# Altium project Speedometer_Tech.PrjPcb
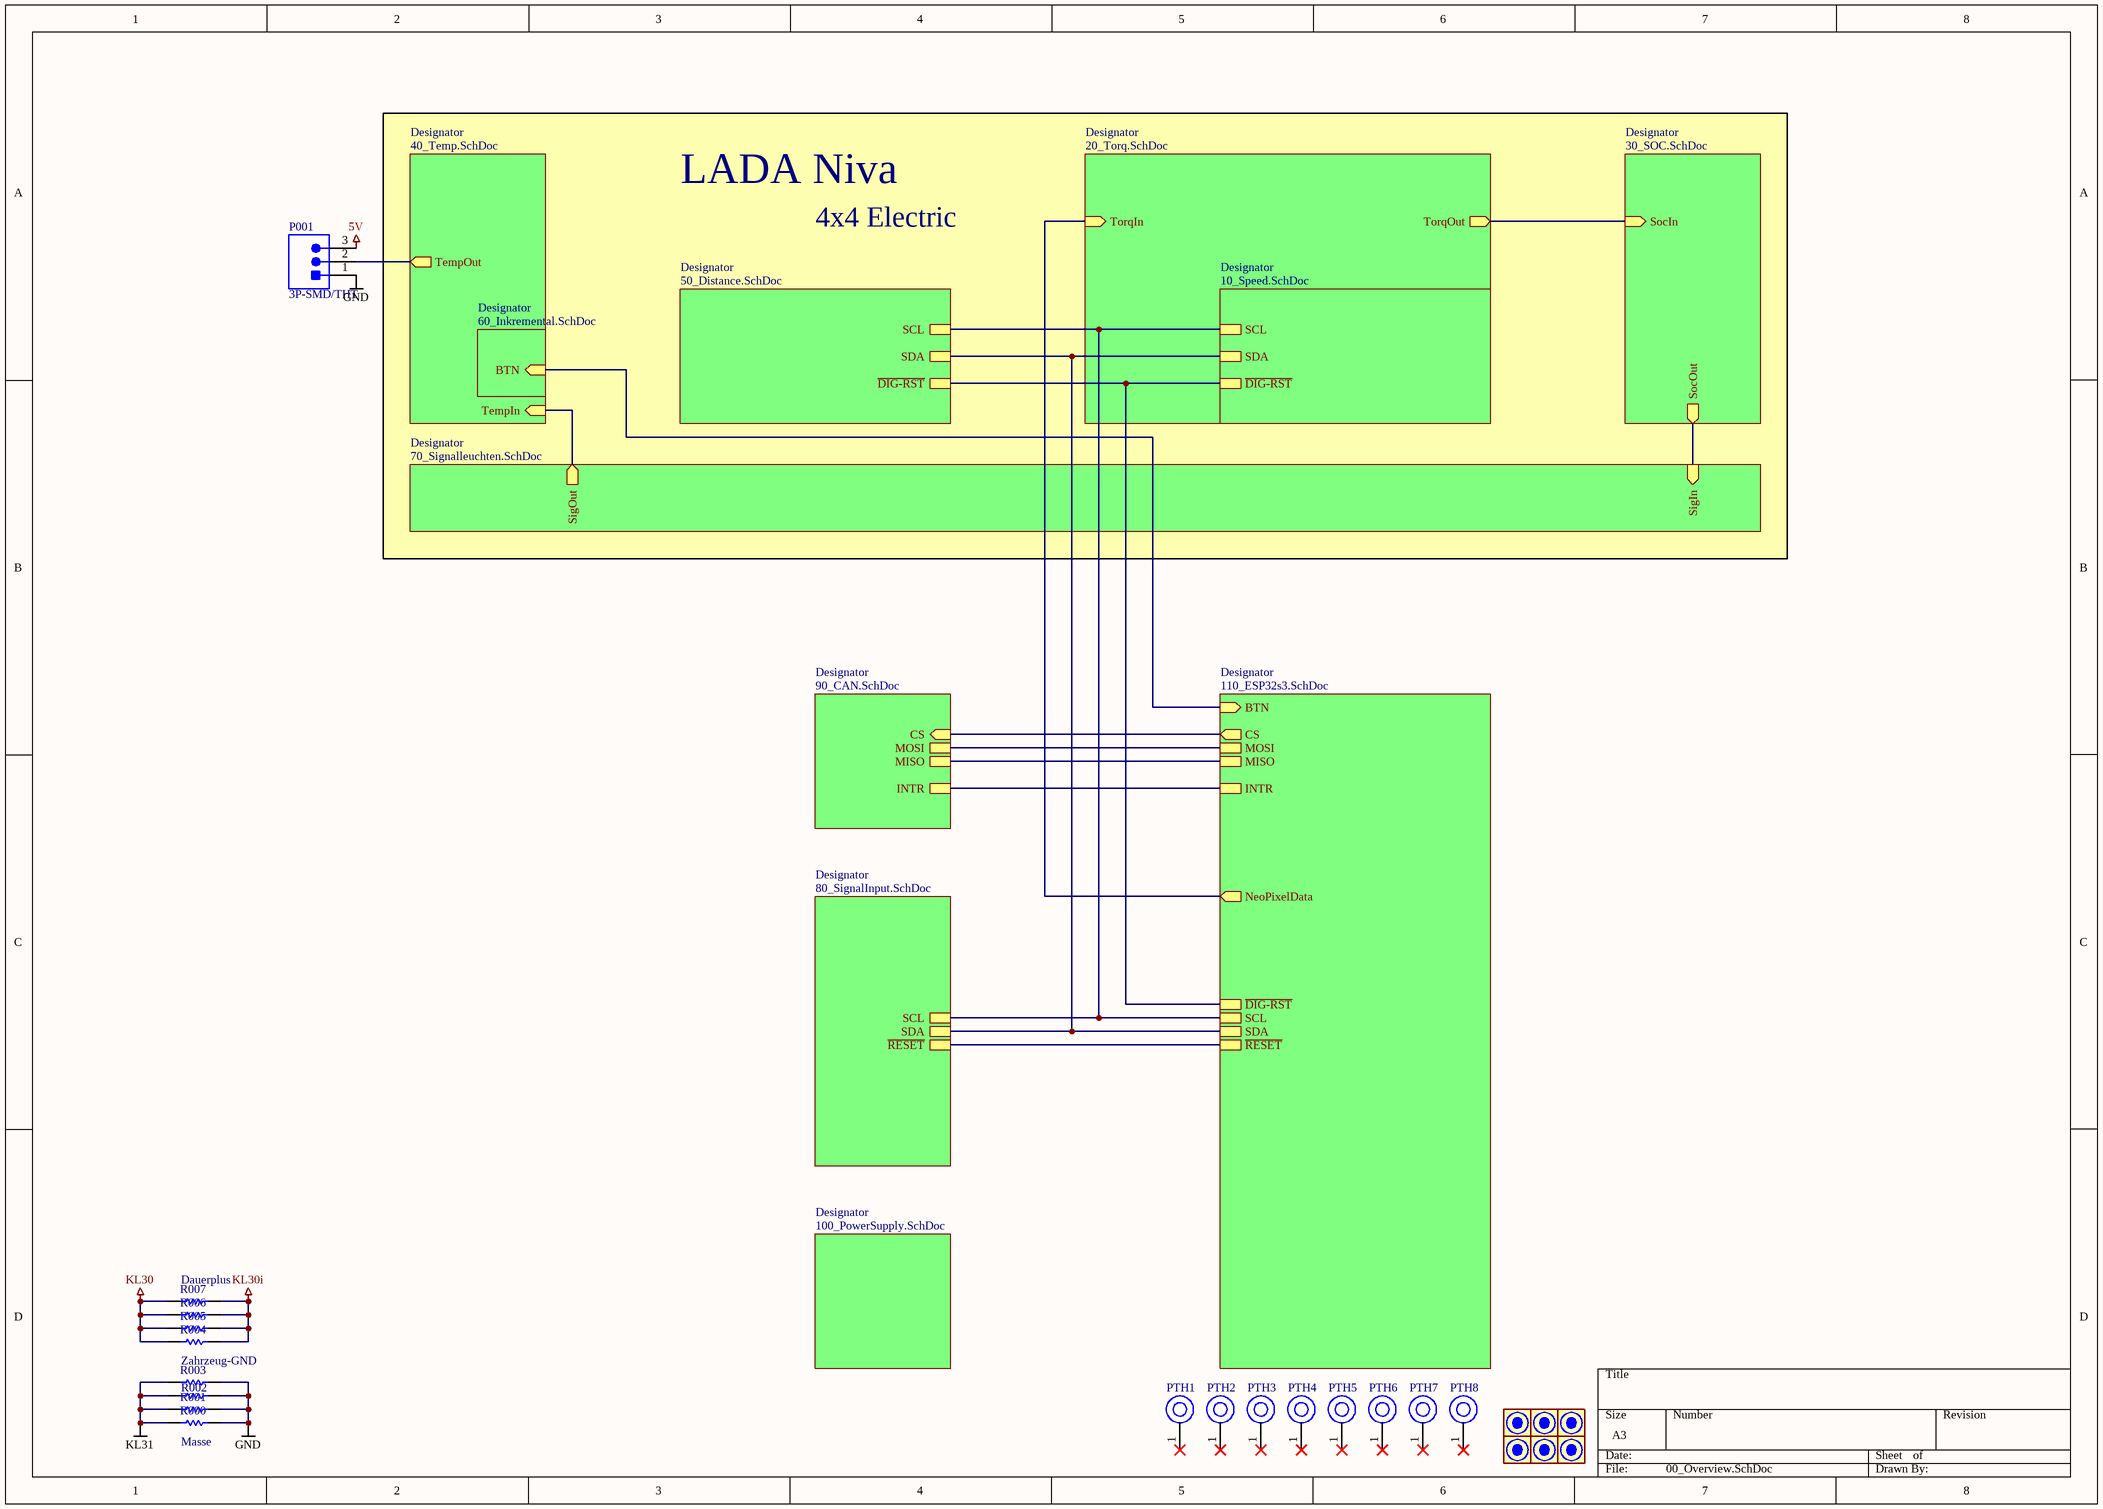
[diagram p0: 00_Overview.SchDoc]
4 sheets, 89 parts. Net scope: hierarchical (ports join the sheet entries above them; power ports are global).
Board file: Speedometer_Tech.PcbDoc
Sheets:
  00_Overview.SchDoc
    Designator = 20_Torq.SchDoc
    Designator = 30_SOC.SchDoc
    Designator = 80_SignalInput.SchDoc

## Sheet 00_Overview.SchDoc
size A3; SheetNumber: 1; SheetTotal: 12

### Parts
(Parts that share a designator on the sheet are numbered #1, #2 ... from top to bottom, then left to right.)
M*#1  Passermarke  [Passermarke-Footprint-1]  (value not drawn)
M*#2  Passermarke  [Passermarke-Footprint-1]  (value not drawn)
M*#3  Passermarke  [Passermarke-Footprint-1]  (value not drawn)
M*#4  Passermarke  [Passermarke-Footprint-1]  (value not drawn)
M*#5  Passermarke  [Passermarke-Footprint-1]  (value not drawn)
M*#6  Passermarke  [Passermarke-Footprint-1]  (value not drawn)
P001  3P-SMD/THT  [3P-SMD/THT]
PTH1  PTH-M4D7X7  [PTH-M4D7X7-Footprint-1]  (value not drawn)
PTH2  PTH-M4D7X7  [PTH-M4D7X7-Footprint-1]  (value not drawn)
PTH3  PTH-M4D7X7  [PTH-M4D7X7-Footprint-1]  (value not drawn)
PTH4  PTH-M4D7X7  [PTH-M4D7X7-Footprint-1]  (value not drawn)
PTH5  PTH-M4D7X7  [PTH-M4D7X7-Footprint-1]  (value not drawn)
PTH6  PTH-M4D7X7  [PTH-M4D7X7-Footprint-1]  (value not drawn)
PTH7  PTH-M4D7X7  [PTH-M4D7X7-Footprint-1]  (value not drawn)
PTH8  PTH-M4D7X7  [PTH-M4D7X7-Footprint-1]  (value not drawn)
R000  RC0603JR-070RL  [RESC1608X55X25ML10T15]  (value not drawn)
R001  RC0603JR-070RL  [RESC1608X55X25ML10T15]  (value not drawn)
R002  RC0603JR-070RL  [RESC1608X55X25ML10T15]  (value not drawn)
R003  RC0603JR-070RL  [RESC1608X55X25ML10T15]  (value not drawn)
R004  RC0603JR-070RL  [RESC1608X55X25ML10T15]  (value not drawn)
R005  RC0603JR-070RL  [RESC1608X55X25ML10T15]  (value not drawn)
R006  RC0603JR-070RL  [RESC1608X55X25ML10T15]  (value not drawn)
R007  RC0603JR-070RL  [RESC1608X55X25ML10T15]  (value not drawn)

### Sub-sheets
Designator = 110_ESP32s3.SchDoc (file not in this document): CS (out), INTR, MOSI, MISO, SCL, SDA, ~{RESET}, NeoPixelData (out), ~{DIG-RST}, BTN (in)
Designator = 20_Torq.SchDoc: TorqIn (in), TorqOut (out)
Designator = 10_Speed.SchDoc (file not in this document): SCL, SDA, ~{DIG-RST}
Designator = 30_SOC.SchDoc: SocIn (in), SocOut (out)
Designator = 40_Temp.SchDoc (file not in this document): TempOut (out), TempIn (in)
Designator = 70_Signalleuchten.SchDoc (file not in this document): SigIn (in), SigOut (out)
Designator = 50_Distance.SchDoc (file not in this document): SCL, SDA, ~{DIG-RST}
Designator = 60_Inkremental.SchDoc (file not in this document): BTN (in)
Designator = 80_SignalInput.SchDoc: SCL, SDA, ~{RESET}
Designator = 100_PowerSupply.SchDoc (file not in this document): no entries
Designator = 90_CAN.SchDoc (file not in this document): CS (in), INTR, MOSI, MISO

### Nets
5V: P001.3
GND: P001.1 R000.2 R001.2 R002.2 R003.2
KL30: R004.1 R005.1 R006.1 R007.1
KL30i: R004.2 R005.2 R006.2 R007.2
KL31: R000.1 R001.1 R002.1 R003.1
NetP001_2: P001.2 ; sheet Designator/TempOut
NetU204_1: sheet Designator/NeoPixelData, sheet Designator/TorqIn
NetU223_3: sheet Designator/TorqOut, sheet Designator/SocIn
NetU320_3: sheet Designator/SocOut, sheet Designator/SigIn
NetU840_12: sheet Designator/SCL, sheet Designator/SCL, sheet Designator/SCL, sheet Designator/SCL
NetU840_13: sheet Designator/SDA, sheet Designator/SDA, sheet Designator/SDA, sheet Designator/SDA
NetU840_18: sheet Designator/~{RESET}, sheet Designator/~{RESET}
(unnamed): sheet Designator/CS, sheet Designator/CS
(unnamed): sheet Designator/INTR, sheet Designator/INTR
(unnamed): sheet Designator/MOSI, sheet Designator/MOSI
(unnamed): sheet Designator/MISO, sheet Designator/MISO
(unnamed): sheet Designator/~{DIG-RST}, sheet Designator/~{DIG-RST}, sheet Designator/~{DIG-RST}
(unnamed): sheet Designator/BTN, sheet Designator/BTN
(unnamed): sheet Designator/TempIn, sheet Designator/SigOut

Not connected (* = marked no-connect by the designer): PTH1 1*; PTH2 1*; PTH3 1*; PTH4 1*; PTH5 1*; PTH6 1*; PTH7 1*; PTH8 1*

### Notes on the sheet
- LADA Niva
- 4x4 Electric
- (near R007) Dauerplus
- Zahrzeug-GND
- (near R000) Masse

### Library data of the parts
M*#1-M*#6 = CMP-00001-2
PTH1-PTH8 = CMP-00028-00009-2: Mounting hole M4
R000 R001 R002 R003 R004 R005 R006 R007 = CMP-2100-03667-1: Chip Resistor, 0 Ohm, +/- 5%, 0.1 W, -55 to 155 degC, 0603 (1608 Metric), RoHS, Tape and Reel; Manufacturer: Yageo; Temperature Coefficient: 200ppm/degreesC; Voltage Rating: 50V; Power Rating: 100mW; Resistance: 0mOhm; Width: 0.8mm; Max Operating Temperature: 155degC; Tolerance: 5%; Package Reference: 0603; Height: 0.45mm; Depth: 0.8mm; Package Description: 2-Pin Surface Mount Device, Body 1.6 x 0.8 mm; Termination: SMD/SMT; Package Quantity: 5000; Case/Package: 0603; Case Code (Imperial): 0603; Radiation Hardening: No; Number of Pins: 2; Length: 1.6mm; Lead Free: LeadFree; Voltage Rating (DC): 50V; Military Standard: Not; Datasheet URL: http://www.yageo.com/NewPortal/yageodocoutput?fileName=/pdf/R-Chip/PYu-RC_Group_51_RoHS_L_5.pdf; Manufacturer URL: http://www.yageo.com/; Packaging: TapeandReel; Case Code (Metric): 1608; Min Operating Temperature: -55degC; Composition: ThickFilm; RoHSCompliant: true; Contact Plating: Tin; Datasheet Version: Rev. 5, 10/2016; REACH SVHC: NoSVHC

## Sheet 20_Torq.SchDoc
size A3; SheetNumber: 3; SheetTotal: 12
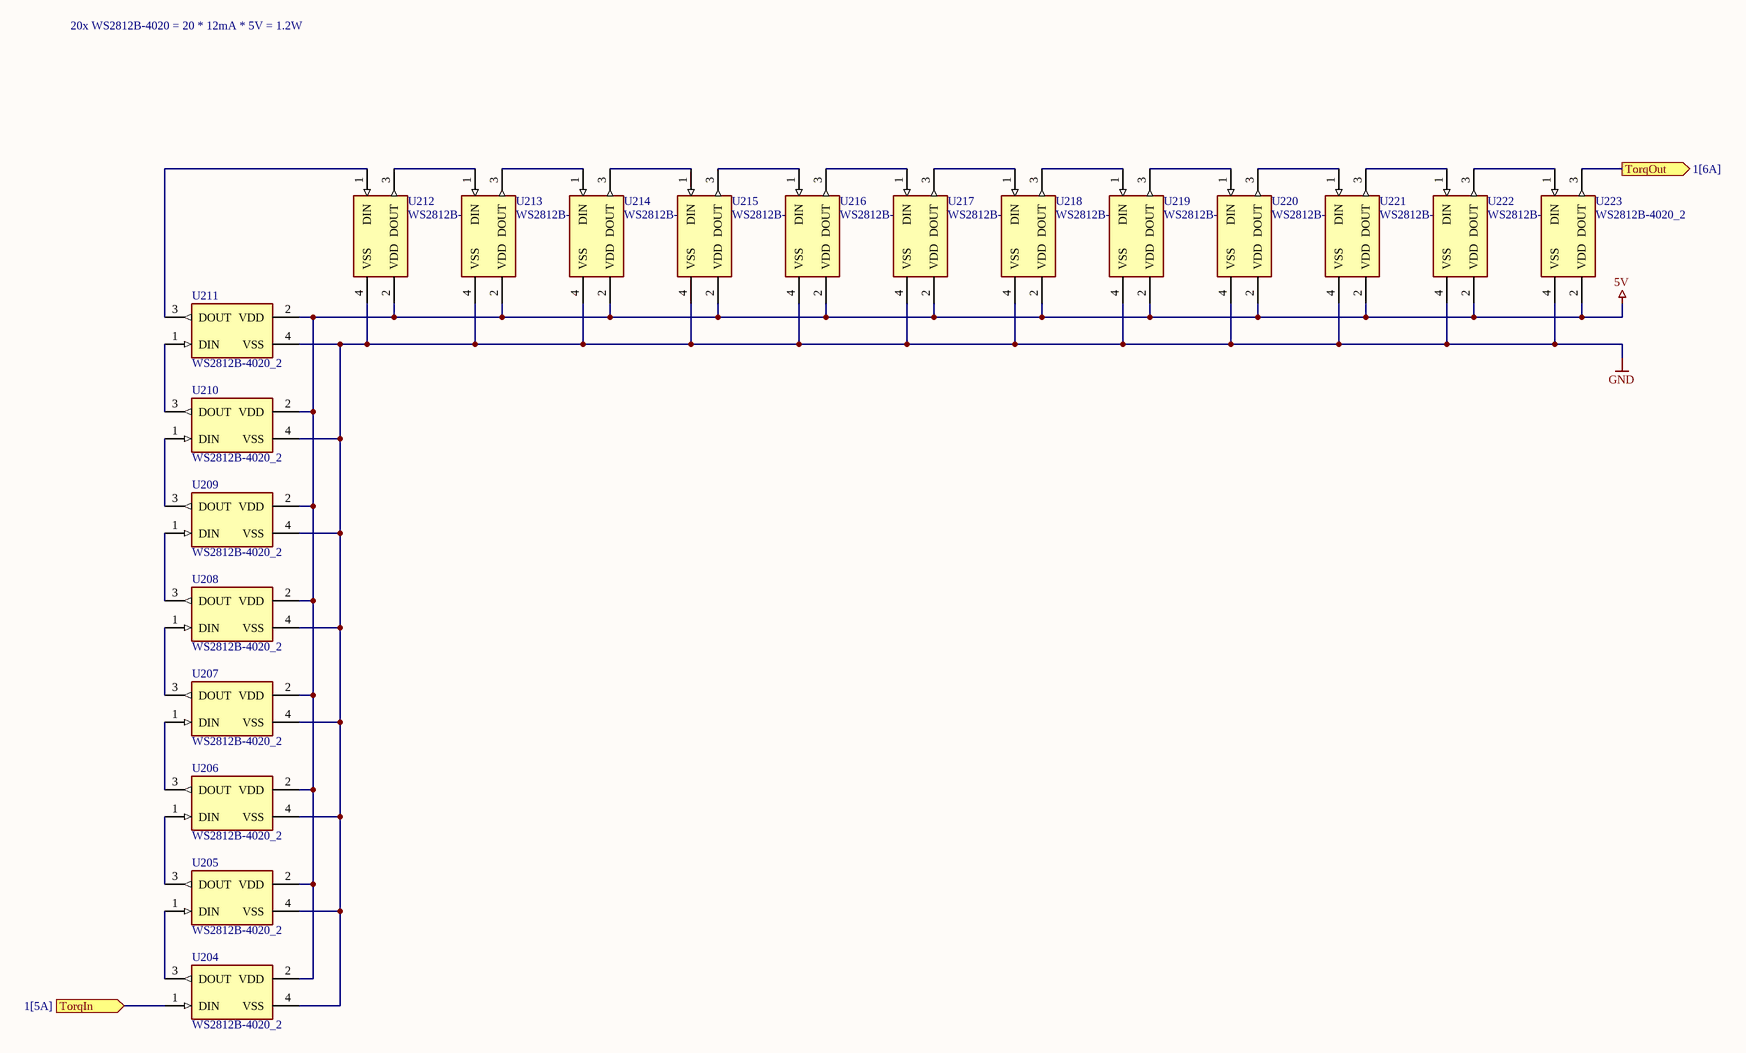
[diagram p1: 20_Torq.SchDoc]

### Parts
U204  WS2812B-4020_2  [LED_WS2812B-4020]
U205  WS2812B-4020_2  [LED_WS2812B-4020]
U206  WS2812B-4020_2  [LED_WS2812B-4020]
U207  WS2812B-4020_2  [LED_WS2812B-4020]
U208  WS2812B-4020_2  [LED_WS2812B-4020]
U209  WS2812B-4020_2  [LED_WS2812B-4020]
U210  WS2812B-4020_2  [LED_WS2812B-4020]
U211  WS2812B-4020_2  [LED_WS2812B-4020]
U212  WS2812B-4020_2  [LED_WS2812B-4020]
U213  WS2812B-4020_2  [LED_WS2812B-4020]
U214  WS2812B-4020_2  [LED_WS2812B-4020]
U215  WS2812B-4020_2  [LED_WS2812B-4020]
U216  WS2812B-4020_2  [LED_WS2812B-4020]
U217  WS2812B-4020_2  [LED_WS2812B-4020]
U218  WS2812B-4020_2  [LED_WS2812B-4020]
U219  WS2812B-4020_2  [LED_WS2812B-4020]
U220  WS2812B-4020_2  [LED_WS2812B-4020]
U221  WS2812B-4020_2  [LED_WS2812B-4020]
U222  WS2812B-4020_2  [LED_WS2812B-4020]
U223  WS2812B-4020_2  [LED_WS2812B-4020]

### Ports
TorqIn (in, see 1[5A]), TorqOut (out, see 1[6A])

### Nets
5V: U204.2(VDD) U205.2(VDD) U206.2(VDD) U207.2(VDD) U208.2(VDD) U209.2(VDD) U210.2(VDD) U211.2(VDD) U212.2(VDD) U213.2(VDD) U214.2(VDD) U215.2(VDD) U216.2(VDD) U217.2(VDD) U218.2(VDD) U219.2(VDD) U220.2(VDD) U221.2(VDD) U222.2(VDD) U223.2(VDD)
GND: U204.4(VSS) U205.4(VSS) U206.4(VSS) U207.4(VSS) U208.4(VSS) U209.4(VSS) U210.4(VSS) U211.4(VSS) U212.4(VSS) U213.4(VSS) U214.4(VSS) U215.4(VSS) U216.4(VSS) U217.4(VSS) U218.4(VSS) U219.4(VSS) U220.4(VSS) U221.4(VSS) U222.4(VSS) U223.4(VSS)
NetU204_1: U204.1(DIN) ; port TorqIn
NetU204_3: U204.3(DOUT) U205.1(DIN)
NetU205_3: U205.3(DOUT) U206.1(DIN)
NetU206_3: U206.3(DOUT) U207.1(DIN)
NetU207_3: U207.3(DOUT) U208.1(DIN)
NetU208_3: U208.3(DOUT) U209.1(DIN)
NetU209_3: U209.3(DOUT) U210.1(DIN)
NetU210_3: U210.3(DOUT) U211.1(DIN)
NetU211_3: U211.3(DOUT) U212.1(DIN)
NetU212_3: U212.3(DOUT) U213.1(DIN)
NetU213_3: U213.3(DOUT) U214.1(DIN)
NetU214_3: U214.3(DOUT) U215.1(DIN)
NetU215_3: U215.3(DOUT) U216.1(DIN)
NetU216_3: U216.3(DOUT) U217.1(DIN)
NetU217_3: U217.3(DOUT) U218.1(DIN)
NetU218_3: U218.3(DOUT) U219.1(DIN)
NetU219_3: U219.3(DOUT) U220.1(DIN)
NetU220_3: U220.3(DOUT) U221.1(DIN)
NetU221_3: U221.3(DOUT) U222.1(DIN)
NetU222_3: U222.3(DOUT) U223.1(DIN)
NetU223_3: U223.3(DOUT) ; port TorqOut

### Notes on the sheet
- 20x WS2812B-4020 = 20 * 12mA * 5V = 1.2W

### Library data of the parts
U204-U223 = WS2812B-4020_2: 12mA RGB SMD,2x4mm Light Emitting Diodes; MF: Worldsemi; Price: None; MP: WS2812B-4020; Availability: Not in stock; SnapEDA_Link: https://www.snapeda.com/parts/WS2812B-4020/Worldsemi/view-part/?ref=snap; Check_prices: https://www.snapeda.com/parts/WS2812B-4020/Worldsemi/view-part/?ref=eda; Value: *; Package: Package

## Sheet 30_SOC.SchDoc
size A3; SheetNumber: 4; SheetTotal: 12
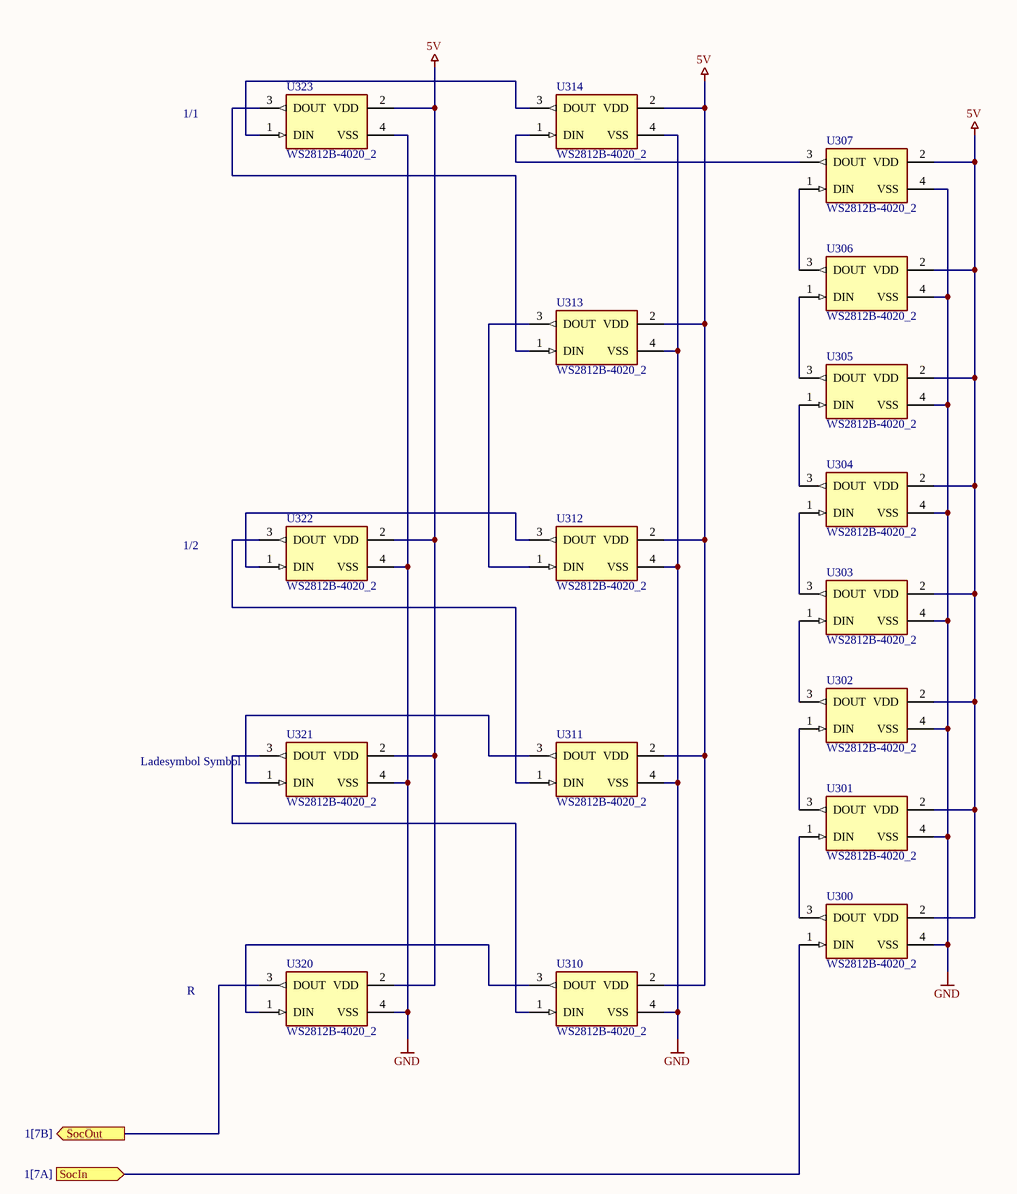
[diagram p2: 30_SOC.SchDoc]

### Parts
U300  WS2812B-4020_2  [LED_WS2812B-4020]
U301  WS2812B-4020_2  [LED_WS2812B-4020]
U302  WS2812B-4020_2  [LED_WS2812B-4020]
U303  WS2812B-4020_2  [LED_WS2812B-4020]
U304  WS2812B-4020_2  [LED_WS2812B-4020]
U305  WS2812B-4020_2  [LED_WS2812B-4020]
U306  WS2812B-4020_2  [LED_WS2812B-4020]
U307  WS2812B-4020_2  [LED_WS2812B-4020]
U310  WS2812B-4020_2  [LED_WS2812B-4020]
U311  WS2812B-4020_2  [LED_WS2812B-4020]
U312  WS2812B-4020_2  [LED_WS2812B-4020]
U313  WS2812B-4020_2  [LED_WS2812B-4020]
U314  WS2812B-4020_2  [LED_WS2812B-4020]
U320  WS2812B-4020_2  [LED_WS2812B-4020]
U321  WS2812B-4020_2  [LED_WS2812B-4020]
U322  WS2812B-4020_2  [LED_WS2812B-4020]
U323  WS2812B-4020_2  [LED_WS2812B-4020]

### Ports
SocIn (in, see 1[7A]), SocOut (out, see 1[7B])

### Nets
5V: U300.2(VDD) U301.2(VDD) U302.2(VDD) U303.2(VDD) U304.2(VDD) U305.2(VDD) U306.2(VDD) U307.2(VDD) U310.2(VDD) U311.2(VDD) U312.2(VDD) U313.2(VDD) U314.2(VDD) U320.2(VDD) U321.2(VDD) U322.2(VDD) U323.2(VDD)
GND: U300.4(VSS) U301.4(VSS) U302.4(VSS) U303.4(VSS) U304.4(VSS) U305.4(VSS) U306.4(VSS) U307.4(VSS) U310.4(VSS) U311.4(VSS) U312.4(VSS) U313.4(VSS) U314.4(VSS) U320.4(VSS) U321.4(VSS) U322.4(VSS) U323.4(VSS)
NetU223_3: U300.1(DIN) ; port SocIn
NetU300_3: U300.3(DOUT) U301.1(DIN)
NetU301_3: U301.3(DOUT) U302.1(DIN)
NetU302_3: U302.3(DOUT) U303.1(DIN)
NetU303_3: U303.3(DOUT) U304.1(DIN)
NetU304_3: U304.3(DOUT) U305.1(DIN)
NetU305_3: U305.3(DOUT) U306.1(DIN)
NetU306_3: U306.3(DOUT) U307.1(DIN)
NetU307_3: U307.3(DOUT) U314.1(DIN)
NetU310_1: U310.1(DIN) U321.3(DOUT)
NetU310_3: U310.3(DOUT) U320.1(DIN)
NetU311_1: U311.1(DIN) U322.3(DOUT)
NetU311_3: U311.3(DOUT) U321.1(DIN)
NetU312_1: U312.1(DIN) U313.3(DOUT)
NetU312_3: U312.3(DOUT) U322.1(DIN)
NetU313_1: U313.1(DIN) U323.3(DOUT)
NetU314_3: U314.3(DOUT) U323.1(DIN)
NetU320_3: U320.3(DOUT) ; port SocOut

### Notes on the sheet
- 1/1
- 1/2
- (near U321) Ladesymbol Symbol
- R

### Library data of the parts
U300-U307 U310-U314 U320-U323 = WS2812B-4020_2: as U204 on sheet 20_Torq; Price: None; MP: WS2812B-4020; Availability: Not in stock; SnapEDA_Link: https://www.snapeda.com/parts/WS2812B-4020/Worldsemi/view-part/?ref=snap; Check_prices: https://www.snapeda.com/parts/WS2812B-4020/Worldsemi/view-part/?ref=eda; Value: *; Package: Package

## Sheet 80_SignalInput.SchDoc
size A3; SheetNumber: 9; SheetTotal: 12
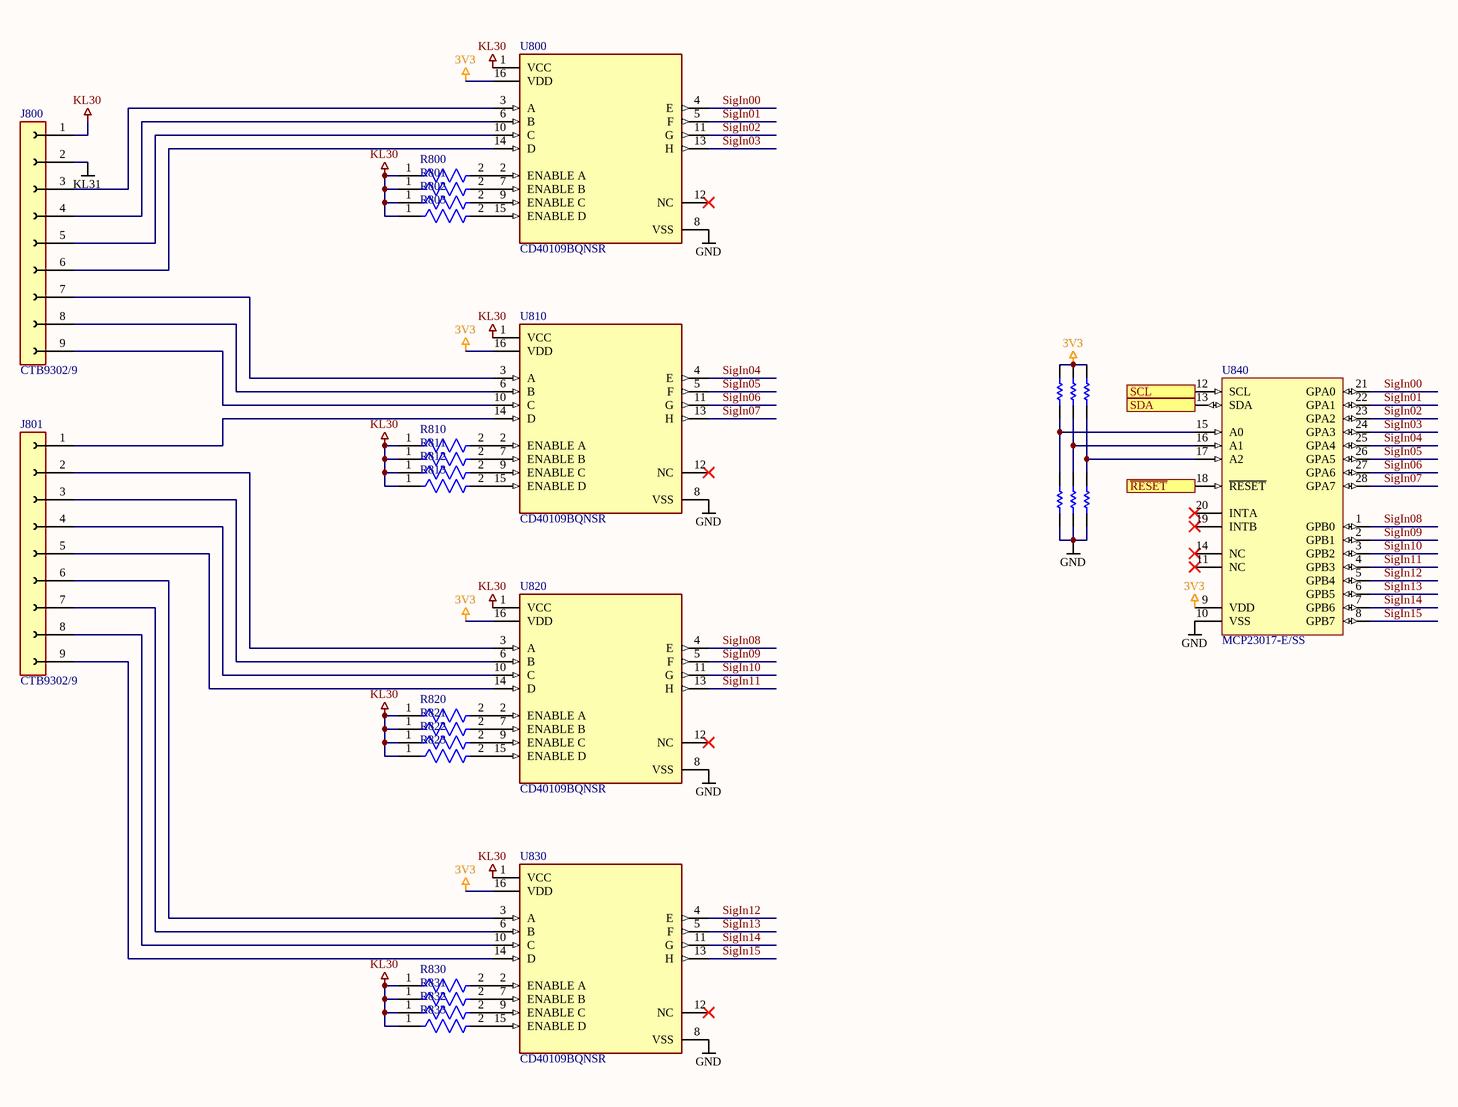
[diagram p3: 80_SignalInput.SchDoc]

### Parts
J800  CTB9302/9  [CTB9302-9]
J801  CTB9302/9  [CTB9302-9]
R800  AC0603FR-071KL  [FP-AC0603-IPC_B]  (value not drawn)
R801  AC0603FR-071KL  [FP-AC0603-IPC_B]  (value not drawn)
R802  AC0603FR-071KL  [FP-AC0603-IPC_B]  (value not drawn)
R803  AC0603FR-071KL  [FP-AC0603-IPC_B]  (value not drawn)
R810  AC0603FR-071KL  [FP-AC0603-IPC_B]  (value not drawn)
R811  AC0603FR-071KL  [FP-AC0603-IPC_B]  (value not drawn)
R812  AC0603FR-071KL  [FP-AC0603-IPC_B]  (value not drawn)
R813  AC0603FR-071KL  [FP-AC0603-IPC_B]  (value not drawn)
R820  AC0603FR-071KL  [FP-AC0603-IPC_B]  (value not drawn)
R821  AC0603FR-071KL  [FP-AC0603-IPC_B]  (value not drawn)
R822  AC0603FR-071KL  [FP-AC0603-IPC_B]  (value not drawn)
R823  AC0603FR-071KL  [FP-AC0603-IPC_B]  (value not drawn)
R830  AC0603FR-071KL  [FP-AC0603-IPC_B]  (value not drawn)
R831  AC0603FR-071KL  [FP-AC0603-IPC_B]  (value not drawn)
R832  AC0603FR-071KL  [FP-AC0603-IPC_B]  (value not drawn)
R833  AC0603FR-071KL  [FP-AC0603-IPC_B]  (value not drawn)
R840  RC0603JR-070RL  [RESC1608X55X25ML10T15]  (value not drawn)
R841  RC0603JR-070RL  [RESC1608X55X25ML10T15]  (value not drawn)
R842  RC0603JR-070RL  [RESC1608X55X25ML10T15]  (value not drawn)
R843  RC0603JR-070RL  [RESC1608X55X25ML10T15]  (value not drawn)
R844  RC0603JR-070RL  [RESC1608X55X25ML10T15]  (value not drawn)
R845  RC0603JR-070RL  [RESC1608X55X25ML10T15]  (value not drawn)
U800  CD40109BQNSR  [FP-NS0016A-IPC_C]
U810  CD40109BQNSR  [FP-NS0016A-IPC_C]
U820  CD40109BQNSR  [FP-NS0016A-IPC_C]
U830  CD40109BQNSR  [FP-NS0016A-IPC_C]
U840  MCP23017-E/SS  [SSOP-SS28_N]

### Ports
SCL (see 1[4C], 2[1C], 6[1C], 12[1B]), SDA (see 1[4C], 2[1C], 6[1C], 12[1B]), ~{RESET} (see 1[4C], 12[2D])

### Nets
3V3: R840.2 R841.2 R842.2 U800.16(VDD) U810.16(VDD) U820.16(VDD) U830.16(VDD) U840.9(VDD)
GND: R843.1 R844.1 R845.1 U800.8(VSS) U810.8(VSS) U820.8(VSS) U830.8(VSS) U840.10(VSS)
KL30: J800.1 R800.1 R801.1 R802.1 R803.1 R810.1 R811.1 R812.1 R813.1 R820.1 R821.1 R822.1 R823.1 R830.1 R831.1 R832.1 R833.1 U800.1(VCC) U810.1(VCC) U820.1(VCC) U830.1(VCC)
KL31: J800.2
SigIn00: U800.4(E) U840.21(GPA0)
SigIn01: U800.5(F) U840.22(GPA1)
SigIn02: U800.11(G) U840.23(GPA2)
SigIn03: U800.13(H) U840.24(GPA3)
SigIn04: U810.4(E) U840.25(GPA4)
SigIn05: U810.5(F) U840.26(GPA5)
SigIn06: U810.11(G) U840.27(GPA6)
SigIn07: U810.13(H) U840.28(GPA7)
SigIn08: U820.4(E) U840.1(GPB0)
SigIn09: U820.5(F) U840.2(GPB1)
SigIn10: U820.11(G) U840.3(GPB2)
SigIn11: U820.13(H) U840.4(GPB3)
SigIn12: U830.4(E) U840.5(GPB4)
SigIn13: U830.5(F) U840.6(GPB5)
SigIn14: U830.11(G) U840.7(GPB6)
SigIn15: U830.13(H) U840.8(GPB7)
NetJ800_3: J800.3 U800.3(A)
NetJ800_4: J800.4 U800.6(B)
NetJ800_5: J800.5 U800.10(C)
NetJ800_6: J800.6 U800.14(D)
NetJ800_7: J800.7 U810.3(A)
NetJ800_8: J800.8 U810.6(B)
NetJ800_9: J800.9 U810.10(C)
NetJ801_1: J801.1 U810.14(D)
NetJ801_2: J801.2 U820.3(A)
NetJ801_3: J801.3 U820.6(B)
NetJ801_4: J801.4 U820.10(C)
NetJ801_5: J801.5 U820.14(D)
NetJ801_6: J801.6 U830.3(A)
NetJ801_7: J801.7 U830.6(B)
NetJ801_8: J801.8 U830.10(C)
NetJ801_9: J801.9 U830.14(D)
NetR800_2: R800.2 U800.2(ENABLE_A)
NetR801_2: R801.2 U800.7(ENABLE_B)
NetR802_2: R802.2 U800.9(ENABLE_C)
NetR803_2: R803.2 U800.15(ENABLE_D)
NetR810_2: R810.2 U810.2(ENABLE_A)
NetR811_2: R811.2 U810.7(ENABLE_B)
NetR812_2: R812.2 U810.9(ENABLE_C)
NetR813_2: R813.2 U810.15(ENABLE_D)
NetR820_2: R820.2 U820.2(ENABLE_A)
NetR821_2: R821.2 U820.7(ENABLE_B)
NetR822_2: R822.2 U820.9(ENABLE_C)
NetR823_2: R823.2 U820.15(ENABLE_D)
NetR830_2: R830.2 U830.2(ENABLE_A)
NetR831_2: R831.2 U830.7(ENABLE_B)
NetR832_2: R832.2 U830.9(ENABLE_C)
NetR833_2: R833.2 U830.15(ENABLE_D)
NetR840_1: R840.1 R843.2 U840.15(A0)
NetR841_1: R841.1 R844.2 U840.16(A1)
NetR842_1: R842.1 R845.2 U840.17(A2)
NetU840_12: U840.12(SCL) ; port SCL
NetU840_13: U840.13(SDA) ; port SDA
NetU840_18: U840.18(~{RESET}) ; port ~{RESET}

Not connected (* = marked no-connect by the designer): U800 12(NC)*; U810 12(NC)*; U820 12(NC)*; U830 12(NC)*; U840 11(NC)* 14(NC)* 19(INTB)* 20(INTA)*

### Library data of the parts
J800 J801 = CTB9302-9: CTB9302/9 - Stiftleiste - 9-pol, RM 5 mm, 0°
R800-R803 R810-R813 R820-R823 R830-R833 = CMP-2000-04828-3: RES 1kΩ 1.00% 0.1W 0603; Voltage Rating: 50V; Power Rating: 100mW; Tolerance: 1%; Temperature Coefficient: 100ppm/°C; Resistance: 1kR; Depth: 0.8mm; Case/Package: 0603; Size Code: 0603; Case Code (Metric): 1608; Height: 0.022inch; Series: AC; Width: 0.031inch; Construction: Rectangular; Length: 0.063inch; Case Code (Imperial): 0603; Package Quantity: 1; RoHS Compliant: Yes; Features: Moisture Resistant; Resistor Type: Thick Film; Max Power Dissipation: 100mW; Packaging: Tape and Reel; Termination: SMD/SMT; Ratings: AEC-Q200; Max Operating Temperature: 155°C; Min Operating Temperature: -55°C; Military Standard: Not; Lead Free: Lead Free; Number of Terminations: 2
R840-R845 = CMP-2100-03667-1: as R000 on sheet 00_Overview; Width: 0.8mm; Max Operating Temperature: 155degC; Tolerance: 5%; Package Reference: 0603; Height: 0.45mm; Depth: 0.8mm; Package Description: 2-Pin Surface Mount Device, Body 1.6 x 0.8 mm; Termination: SMD/SMT; Package Quantity: 5000; Case/Package: 0603; Case Code (Imperial): 0603; Radiation Hardening: No; Number of Pins: 2; Length: 1.6mm; Lead Free: LeadFree; Voltage Rating (DC): 50V; Military Standard: Not; Datasheet URL: http://www.yageo.com/NewPortal/yageodocoutput?fileName=/pdf/R-Chip/PYu-RC_Group_51_RoHS_L_5.pdf; Manufacturer URL: http://www.yageo.com/; Packaging: TapeandReel; Case Code (Metric): 1608; Min Operating Temperature: -55degC; Composition: ThickFilm; RoHSCompliant: true; Contact Plating: Tin; Datasheet Version: Rev. 5, 10/2016; REACH SVHC: NoSVHC
U800 U810 U820 U830 = CMP-04899-000094-1: IC TRNSLTR UNIDIRECTIONAL 16SO; Max Supply Voltage: 18V; Number of Channels: 4; Propagation Delay: 240ns; High Level Output Current: -4mA; Logic Function: Level Shifter; Turn-On Delay Time: 740ns; Data Rate: 10Mbps; Min Supply Voltage: 3V; Low Level Output Current: 4mA; Quiescent Current: 20uA; Output Type: Voltage; Packaging: Tape and Reel; Mount: Surface Mount; Contact Plating: Gold; Min Operating Temperature: -40°C; Number of Circuits: 4; Lead Free: Lead Free; Max Operating Temperature: 125°C; Radiation Hardening: No; Channel Type: Unidirectional; RoHS Compliant: Yes; Series: 4000B; Package Quantity: 2000; Number of Pins: 16; Technology: CMOS; Case/Package: SOP; Number of Bits: 4
U840 = CMP-0186-00176-2: 16-Bit I/O Expander with Serial Interface, 28-Pin SSOP, Extended Temperature; PackageVersion: revBB, Aug-2009; ComponentLink1Description: Manufacturer URL; ComponentLink3Description: Package Specification; PackageDescription: 28-Lead Plastic Shrink Small Outline (SS) - 5.3mm Body [SSOP]; ComponentLink1URL: http://www.microchip.com/; Code_JEDEC: MS-150; RevisionNote: URLs added.; ComponentLink3URL: http://www.microchip.com/stellent/groups/techpub_sg/documents/packagingspec/en012702.pdf; ComponentLink2URL: http://ww1.microchip.com/downloads/en/DeviceDoc/21952b.pdf; ComponentLink2Description: Datasheet; PackageReference: SSOP-SS28; DatasheetVersion: revB, Feb-2007

## Nets that join several sheets
5V: 00_Overview (P001.3), 20_Torq (20 pins), 30_SOC (17 pins)
GND: 00_Overview (5 pins), 20_Torq (20 pins), 30_SOC (17 pins), 80_SignalInput (8 pins)
KL30: 00_Overview (R004.1 R005.1 R006.1 R007.1), 80_SignalInput (21 pins)
KL31: 00_Overview (R000.1 R001.1 R002.1 R003.1), 80_SignalInput (J800.2)
NetU223_3: 20_Torq (U223.3), 30_SOC (U300.1)